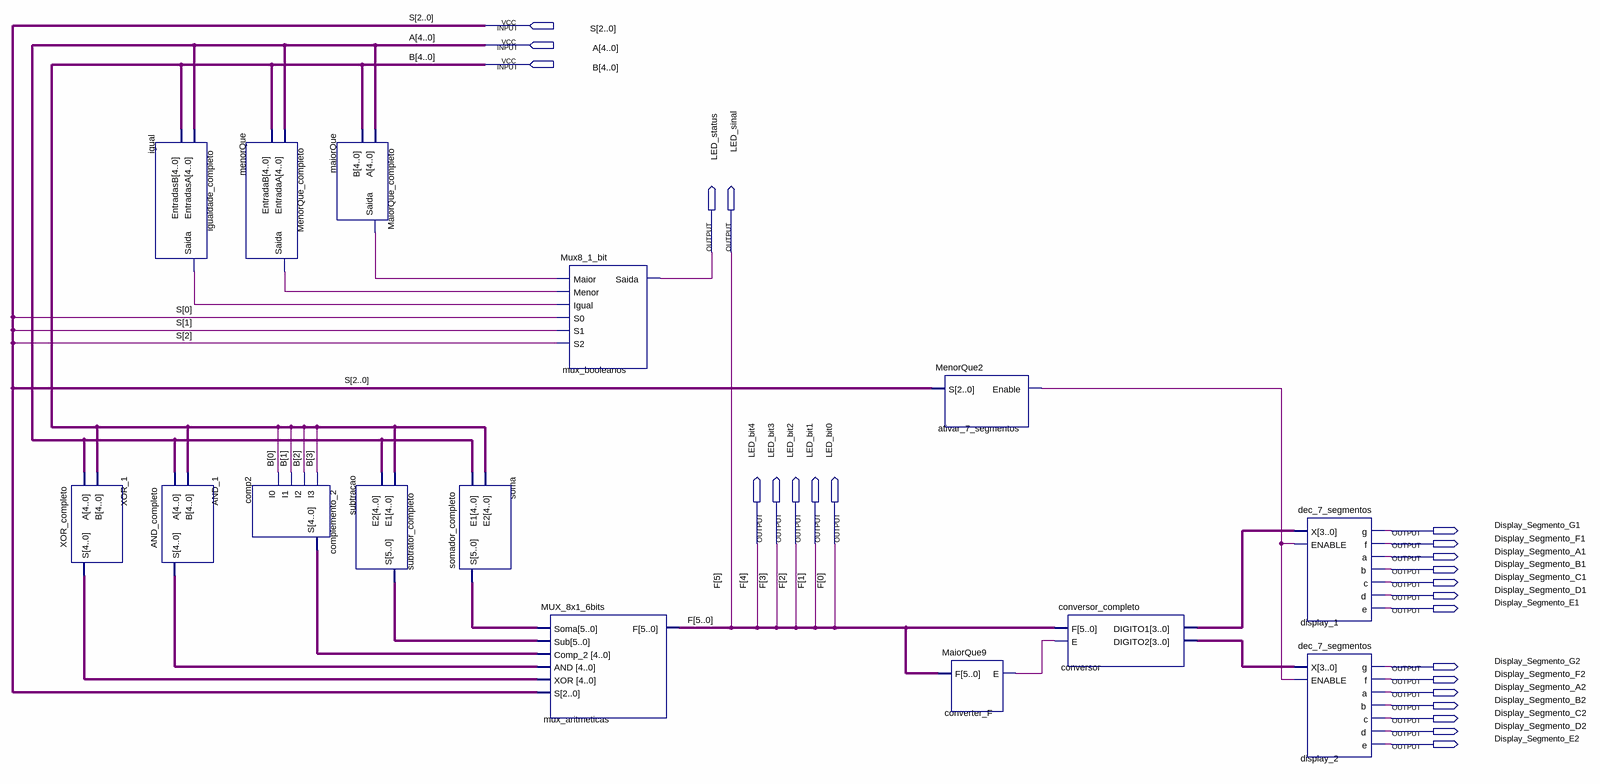
[diagram p0: schematic sheet]
// Quartus schematic ULA_completo.bdf as structural Verilog: 15 symbols, 24 pins
module ULA_completo (
  input  [2:0] S,
  input  [4:0] A,
  input  [4:0] B,
  output LED_status,
  output LED_sinal,
  output Display_Segmento_G1,
  output LED_bit4,
  output LED_bit3,
  output LED_bit2,
  output LED_bit1,
  output LED_bit0,
  output Display_Segmento_F1,
  output Display_Segmento_A1,
  output Display_Segmento_B1,
  output Display_Segmento_C1,
  output Display_Segmento_D1,
  output Display_Segmento_E1,
  output Display_Segmento_G2,
  output Display_Segmento_F2,
  output Display_Segmento_A2,
  output Display_Segmento_B2,
  output Display_Segmento_C2,
  output Display_Segmento_D2,
  output Display_Segmento_E2
);

  wire ativar_7_segmentos_enable, converter_F_e, igual_saida, maiorQue_saida, menorQue_saida;
  wire [3:0] conversor_digito1, conversor_digito2;
  wire [4:0] AND_1_s, comp2_s, XOR_1_s;
  wire [5:0] soma_s, subtracao_s;

  XOR_completo XOR_1 (.A(A), .B(B), .S(XOR_1_s));
  igualdade_completo igual (.EntradasA(A), .EntradasB(B), .Saida(igual_saida));
  AND_completo AND_1 (.A(A), .B(B), .S(AND_1_s));
  MenorQue_completo menorQue (.EntradaA(A), .EntradaB(B), .Saida(menorQue_saida));
  complemento_2 comp2 (.I3(B[3]), .I2(B[2]), .I1(B[1]), .I0(B[0]), .S(comp2_s));
  MaiorQue_completo maiorQue (.A(A), .B(B), .Saida(maiorQue_saida));
  subtrator_completo subtracao (.E1(B), .E2(A), .S(subtracao_s));
  somador_completo soma (.E1(A), .E2(B), .S(soma_s));
  Mux8_1_bit mux_booleanos (
    .Maior(maiorQue_saida), .Menor(menorQue_saida), .Igual(igual_saida), .S0(S[0]), .S1(S[1]), .S2(S[2]),
    .Saida(LED_status));
  MUX_8x1_6bits mux_aritmeticas (
    .Soma(soma_s), .Sub(subtracao_s), .Comp_2(comp2_s), .AND(AND_1_s), .XOR(XOR_1_s), .S(S),
    .F({LED_sinal, LED_bit4, LED_bit3, LED_bit2, LED_bit1, LED_bit0}));
  MenorQue2 ativar_7_segmentos (.S(S), .Enable(ativar_7_segmentos_enable));
  MaiorQue9 converter_F (.F({LED_sinal, LED_bit4, LED_bit3, LED_bit2, LED_bit1, LED_bit0}), .E(converter_F_e));
  conversor_completo conversor (
    .F({LED_sinal, LED_bit4, LED_bit3, LED_bit2, LED_bit1, LED_bit0}), .E(converter_F_e),
    .DIGITO1(conversor_digito1), .DIGITO2(conversor_digito2));
  dec_7_segmentos display_1 (
    .X(conversor_digito1), .ENABLE(ativar_7_segmentos_enable), .g(Display_Segmento_G1),
    .f(Display_Segmento_F1), .a(Display_Segmento_A1), .b(Display_Segmento_B1), .c(Display_Segmento_C1),
    .d(Display_Segmento_D1), .e(Display_Segmento_E1));
  dec_7_segmentos display_2 (
    .X(conversor_digito2), .ENABLE(ativar_7_segmentos_enable), .g(Display_Segmento_G2),
    .f(Display_Segmento_F2), .a(Display_Segmento_A2), .b(Display_Segmento_B2), .c(Display_Segmento_C2),
    .d(Display_Segmento_D2), .e(Display_Segmento_E2));

  // Other names for the same wires on the sheet: F[5:0] = {LED_sinal, LED_bit4, LED_bit3, LED_bit2, LED_bit1, LED_bit0}
endmodule
